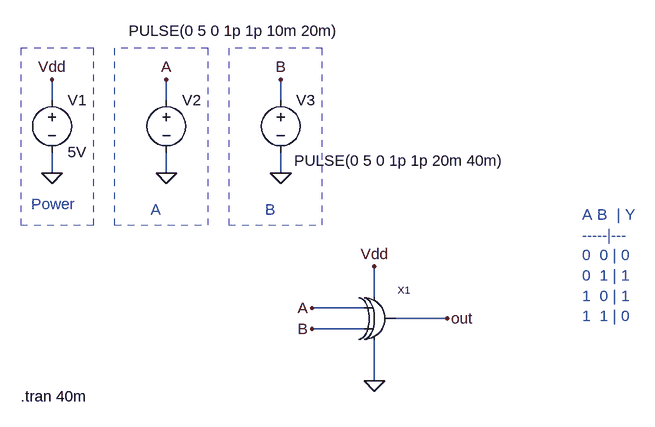
[diagram p0: schematic xor_block.asc]
xor_block.asc, the LTspice schematic file:
Version 4
SHEET 1 880 680
WIRE -560 -416 -560 -448
WIRE -384 -416 -384 -448
WIRE -208 -416 -208 -448
WIRE -560 -304 -560 -336
WIRE -384 -304 -384 -336
WIRE -208 -304 -208 -336
WIRE -64 -112 -64 -160
WIRE -80 -96 -160 -96
WIRE 48 -80 -32 -80
WIRE -80 -64 -160 -64
WIRE -64 16 -64 -48
FLAG 48 -80 out
FLAG -160 -96 A
FLAG -64 -160 Vdd
FLAG -64 16 0
FLAG -560 -304 0
FLAG -560 -448 Vdd
FLAG -384 -304 0
FLAG -384 -448 A
FLAG -160 -64 B
FLAG -208 -304 0
FLAG -208 -448 B
SYMBOL voltage -560 -432 R0
WINDOW 123 0 0 Left 0
WINDOW 39 0 0 Left 0
SYMATTR InstName V1
SYMATTR Value 5V
SYMBOL voltage -384 -432 R0
WINDOW 123 0 0 Left 0
WINDOW 39 0 0 Left 0
WINDOW 3 -58 -91 Left 2
SYMATTR Value PULSE(0 5 0 1p 1p 10m 20m)
SYMATTR InstName V2
SYMBOL voltage -208 -432 R0
WINDOW 123 0 0 Left 0
WINDOW 39 0 0 Left 0
WINDOW 3 21 109 Left 2
SYMATTR Value PULSE(0 5 0 1p 1p 20m 40m)
SYMATTR InstName V3
SYMBOL xor -96 -48 R0
SYMATTR InstName X1
TEXT -592 -256 Left 2 ;Power
TEXT -408 -248 Left 2 ;A
TEXT -608 40 Left 2 !.tran 40m
TEXT -232 -248 Left 2 ;B
TEXT 256 -240 Left 2 ;A B  | Y\n-----|---\n0  0 | 0\n0  1 | 1\n1  0 | 1\n1  1 | 0
RECTANGLE Normal -496 -496 -608 -224 2
RECTANGLE Normal -320 -496 -464 -224 2
RECTANGLE Normal -144 -496 -288 -224 2

The netlist it stands for:
* xor_block.asc
V1 Vdd 0 5V
V2 A 0 PULSE(0 5 0 1p 1p 10m 20m)
V3 B 0 PULSE(0 5 0 1p 1p 20m 40m)
XX1 A B out Vdd 0 xor  ; pins A B Y Vdd Vss
* Power
* A
.tran 40m
* B
* A B  | Y
* -----|---
* 0  0 | 0
* 0  1 | 1
* 1  0 | 1
* 1  1 | 0
.backanno
.end